# Altium schematic sheet LED Module_v2_SCH.schdoc
size 431 x 279 mm; Symbol: Drawing-Symbol_A4; @Project Name: New Project_2026-06-09_20-18-47; @Page Count: 1; @Update Date: 2026-06-09; @Create Date: 2026-06-09; @Schematic Name: Schematic1; @Page No: 1; @Page Name: P1; Company: EasyEDA.com; Version: V1.0; Page Size: A4; Device: Drawing-Symbol_A4; @Create Time: 20:19:00; @Update Time: 20:19:00; Border: 1; Width: 1170; Height: 825; Region Start: 1; X Region Count: 6; Y Region Count: 4; Blade Width: 10; Title Block Position: 3; @Board Name: Board1; SheetNumber: 1; SheetTotal: 1
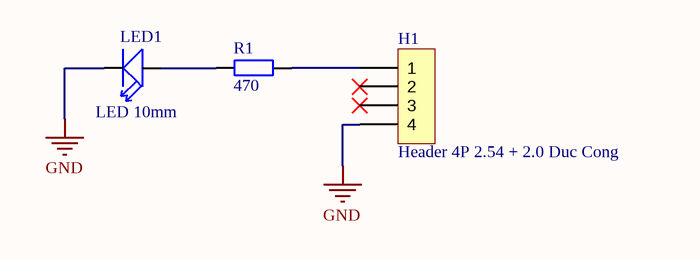
[diagram p0: LED Module_v2_SCH.schdoc]

## Parts
H1  Header 4P 2.54 + 2.0 Duc Cong  [Header 4P DC 2.54 + 2.0]
LED1  LED 10mm  [LED2-2.54-D10MM]
R1  470  [tro smd 0603]

## Nets
GND: H1.4 LED1.NEG
NetH1_1: H1.1 R1.2
NetLED1_POS: LED1.POS R1.1

Not connected (* = marked no-connect by the designer): H1 2* 3*

## Notes on the sheet
- DWG. NO.
- REV.
- SHT.
- THIS DOCUMENT AND THE DATA DISCLOSED HEREIN OR HEREWITH IS THE PROPERTY OF ALTIUM LIMITED AND MAY BE FREELY DISTRIBUTED IN WHOLE. NO RIGHTS ARE RESERVED OR EXPRESS OR IMPLIED WARANTEE GIVEN.
- REVISION
- DESCRIPTION
- DATE
- APPROVED
- ENG:
- APPROVALS
- PROJECT
- DSN:
- CHK:
- REFERENCE DOCUMENTS
- PROJECT REVISION:
- TITLE
- DOCUMENT REVISION:
- DESIGN ITEM:
- BOM:
- FAB DWG:
- PCB DWG:
- ASSY DWG:
- SCALE:
- SIZE
- B
- CAGE CODE
- FILE NAME
- DWG NO.
- SHEET
- OF
- REV

## Library data of the parts
H1 = Header 4P 2.54 + 2.0 Duc Cong: Cắm; Ten_Linh_Kien: Header 4P XH2.54-4P Đực Cong; Don_Vi: Con; Ma_Hang: MH001310; Chung_Loai: Cắm
LED1 = LED 10mm: 304090142; MP: DIP-LED-BLUE-BLUE-10MM(2P-D10MM); Package: None; Price: None; Value: *; Availability: Unavailable
R1 = Tro 0603 5% 330R: Dán; Don_Vi: Con; Ma_Hang: MH006910; So_Chan: 2; Ten_Linh_Kien: Trở 0603 5% 330R; Chung_Loai: Dán; Kieu_Chan: *